# Altium schematic sheet 0301_LTC6820_chip.SchDoc
size A3; DocumentNumber: 6; SheetNumber: 6; SheetTotal: 6; SheetDescription: LTC6820
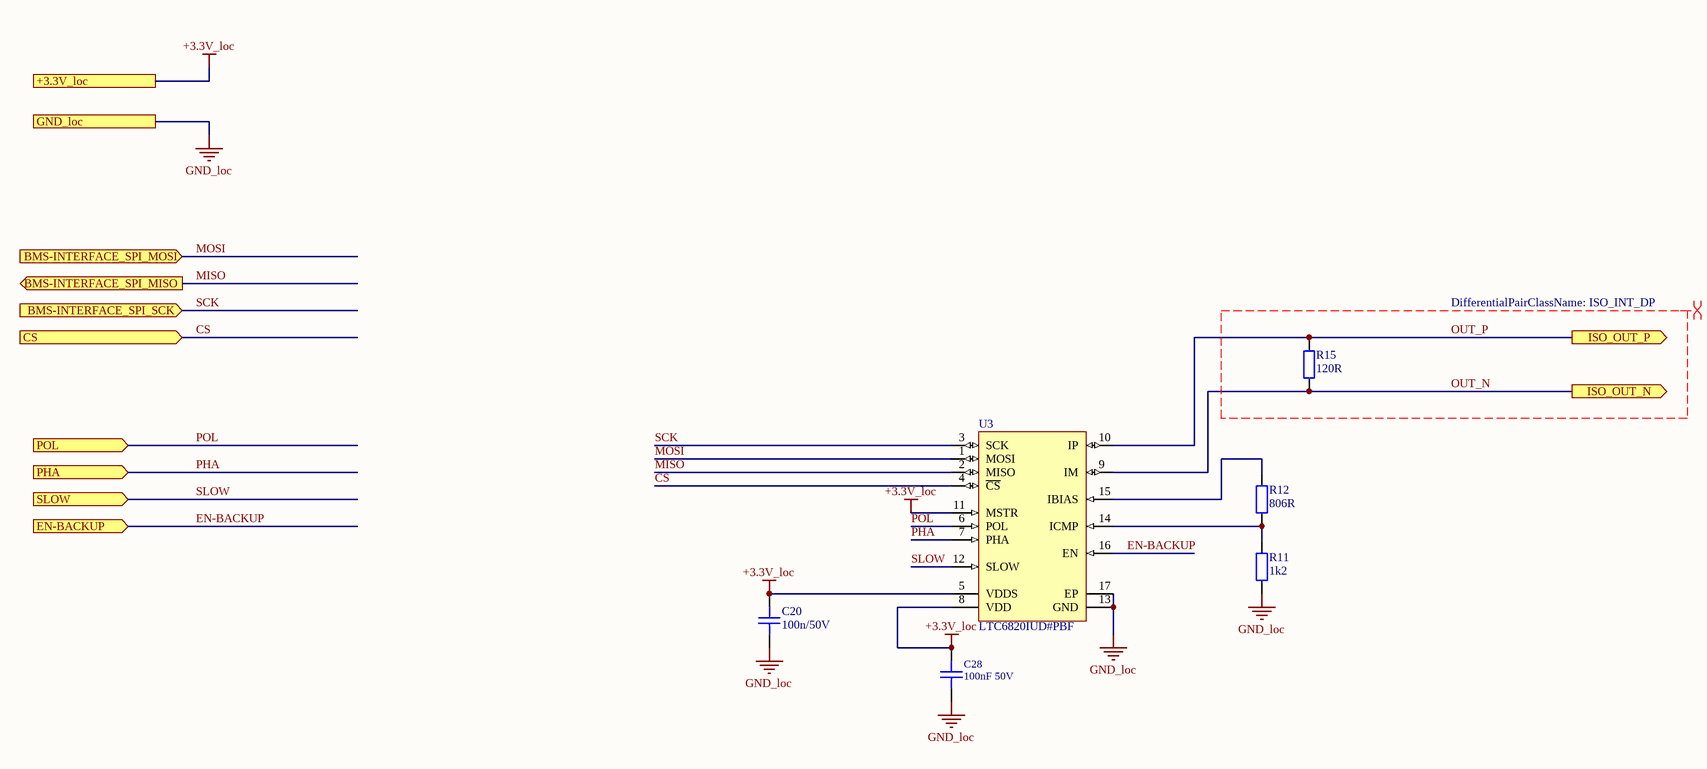
[diagram p0: 0301_LTC6820_chip.SchDoc]

## Parts
C20  100n/50V  [0603C]
C28  100nF 50V  [0603C]
R11  1k2  [0603R]
R12  806R  [0603R]
R15  120R  [0603R]
U3  LTC6820IUD#PBF  [LT-UD-16-EPV-AA_L]

## Ports
+3.3V_loc, BMS-INTERFACE_SPI_MISO (out), BMS-INTERFACE_SPI_MOSI (in), BMS-INTERFACE_SPI_SCK (in), CS (in), EN-BACKUP (in), GND_loc, ISO_OUT_N (out), ISO_OUT_P (out), PHA (in), POL (in), SLOW (in)

## Nets
+3.3V_loc: C20.2 C28.2 U3.5(VDDS) U3.8(VDD) U3.11(MSTR) ; port +3.3V_loc
GND_loc: C20.1 C28.1 R11.1 U3.13(GND) U3.17(EP) ; port GND_loc
CS: U3.4(~{CS}) ; port CS
EN-BACKUP: U3.16(EN) ; port EN-BACKUP
MISO: U3.2(MISO) ; port BMS-INTERFACE_SPI_MISO
MOSI: U3.1(MOSI) ; port BMS-INTERFACE_SPI_MOSI
OUT_N: R15.1 U3.9(IM) ; port ISO_OUT_N
OUT_P: R15.2 U3.10(IP) ; port ISO_OUT_P
PHA: U3.7(PHA) ; port PHA
POL: U3.6(POL) ; port POL
SCK: U3.3(SCK) ; port BMS-INTERFACE_SPI_SCK
SLOW: U3.12(SLOW) ; port SLOW
NetR11_2: R11.2 R12.1 U3.14(ICMP)
NetR12_2: R12.2 U3.15(IBIAS)

## Layout directives
differential pair; differential pair class ISO_INT_DP: OUT_N, OUT_P

## Notes on the sheet
- Fraunhofer IISB
- Schottkystr. 10
- developed by:
- 91058 Erlangen
- Germany
- Author
- Project
- License
- Description
- File
- Version
- Release Date
- Sheet
- www.foxbms.org
- www.iisb.fraunhofer.de
- foxBMS Team
- /

## Library data of the parts
C20 = gen_C_ceramic_100n_50V_X7R_0603: MLCC; Capacitance: 100n; Rated Voltage: 50V; Dielectric: X7R; Case EIA: 0603; Case Metric: 1608; PnP Package: C_0603_10; PnP Value: 100n/50V/X7R; PnP equipped: x; Automotive Qualified: True; Part Number: gen_C_ceramic_100n_50V_X7R_0603; Supplier 1: Farnell; Supplier Part Number 1: 2525267; Supplier 2: Digikey; Supplier Part Number 2: 490-6049-1-ND; Supplier 3: Farnell; Supplier Part Number 3: 2070398
C28 = gen_C_ceramic_100n_50V_X7R_0603: Ceramic, 100nF, ±10%, 50V, X7R, –55 to 125°C, 0603 (1608),RoHS, Automotive; Part Number: GCJ188R71H104KA12; Manufacturer: Murata; Capacitance: 100n; Case EIA: 0603; Case Metric: 1608; PnP Package: C_0603_10; PnP Value: 100nF/50V/X7R; Automotive Qualified: True; Rated Voltage: 50V; Dielectric: X7R; Supplier 1: Digi-Key; Supplier Part Number 1: 490-5798-1-ND; Height - Seated (Max): 0.8mm; Mounting Type: SurfaceMount,MLCC; Operating Temperature: –55 to 125°C; Series: GCJ; Tolerance: ±10%; Manufacturer_Part_Number: GCJ188R71H104KA12
R11 = gen_R_1k2_0603: SMD Resistor 1k2 0603; Tolerance: 1%; Power: 0.1W; Case EIA: 0603; Case Metric: 1608; Maximum Working Voltage: 75V; PnP Package: R_0603; Automotive Qualified: True; Part Number: gen_R_1k2_0603; Operating Temperature: -55°C - +155°C; Resistance: 1k2; Series: E24; PnP Value: 1k2; Supplier 1: Farnell; Supplier Part Number 1: 2073370
R12 = gen_R_806R_0603: SMD Resistor 806R 0603; Tolerance: 1%; Power: 0.1W; Case EIA: 0603; Case Metric: 1608; Maximum Working Voltage: 75V; PnP Package: R_0603; Automotive Qualified: True; Part Number: gen_R_806R_0603; Operating Temperature: -55°C - +155°C; Resistance: 806R; Series: E96; PnP Value: 806R; Supplier 1: Farnell; Supplier Part Number 1: 2059324
R15 = gen_R_120R_0603: SMD Resistor 120R 0603; Tolerance: 1%; Power: 0.1W; Case EIA: 0603; Case Metric: 1608; Maximum Working Voltage: 75V; PnP Package: R_0603; Automotive Qualified: True; Part Number: gen_R_120R_0603; Operating Temperature: -55°C - +155°C; Resistance: 120R; Series: E24; PnP Value: 120R; Supplier 1: Farnell; Supplier Part Number 1: 1652832
U3 = CMP-0937-00013-1: IsoSPI Isolated Communication Interface, 2.7 to 5.5 V, -40 to 85 degC, 16-Pin QFN (UD-16EPV-AA), Pb-Free; Manufacturer: Linear Technology; VBIAS: 1.9 to 2.1 V; Receiver Input Resistance: 35 kOhm; IO Supply Voltage Range: 1.7 to 5.5 V; IO Supply Current: 1 uA Max.; Supply Current, IDLE State: 2 uA; ComponentLink3URL: http://cds.linear.com/docs/en/packaging/QFN_16_05-08-1700.pdf; PackageReference: UD-16EPV-AA; ComponentLink1URL: http://www.linear.com/; PartNumber: LTC6820IUD#PBF; Temperature Range (degC): -40 to 85; Mounting Technology: Surface Mount; PackageDescription: 16-Pin Quad Flat No-lead Package, Body 3 x 3 mm, Pitch 0.5 mm; DatasheetVersion: Rev. A; ComponentLink2Description: Datasheet; ComponentLink1Description: Manufacturer URL; PackageVersion: Rev. A; Power Supply: 2.7 to 5.5 V; ComponentLink2URL: http://cds.linear.com/docs/en/datasheet/6820fa.pdf; ComponentLink3Description: Package Specification